# EAGLE schematic CDTV-Clockport (EAGLE 4.16)
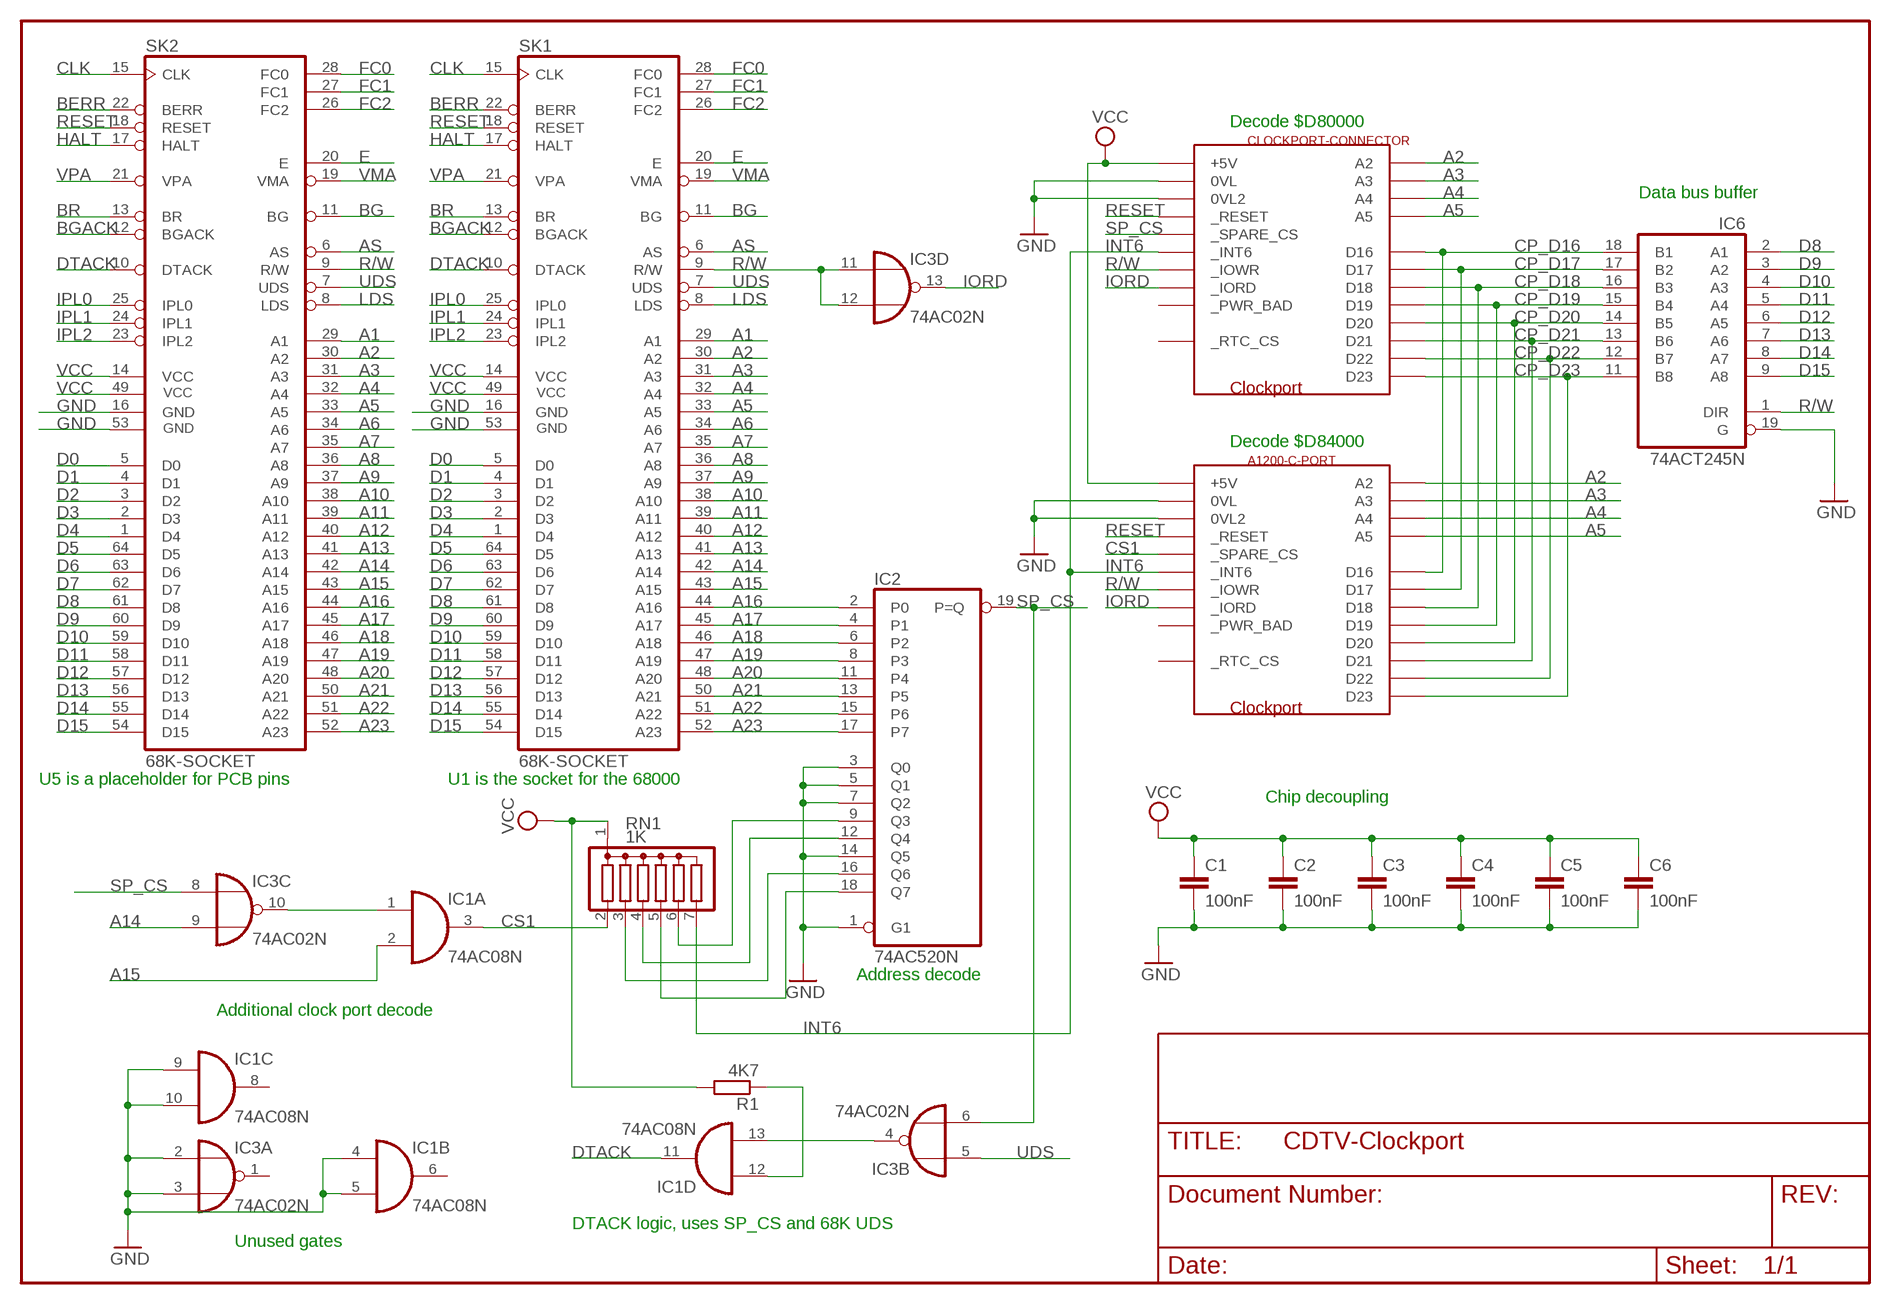
[diagram p0: schematic, sheet 1]

## Parts
C1  100nF  C-EU050-030X075  [C050-030X075]
C2  100nF  C-EU050-030X075  [C050-030X075]
C3  100nF  C-EU050-030X075  [C050-030X075]
C4  100nF  C-EU050-030X075  [C050-030X075]
C5  100nF  C-EU050-030X075  [C050-030X075]
C6  100nF  C-EU050-030X075  [C050-030X075]
CN1  A1200-C-PORT  [2MM-PCB-HEADER]
CN$1  CLOCKPORT-CONNECTOR  [2MM-PCB-HEADER]
IC1  74AC08N  [DIL14]
IC2  74AC520N  [DIL20]
IC3  74AC02N  [DIL14]
IC6  74ACT245N  [DIL20]
R1  4K7  R-EU_0207/7  [0207/7]
RN1  1K  G06R  [SIL7]
SK1  68K-SOCKET  [DIL64-SKT]
SK2  68K-SOCKET  [DIL64-SKT]

## Nets
A1: SK1.29(A1) SK2.29(A1)
A2: CN1.PIN12(A2) CN$1.PIN12(A2) SK1.30(A2) SK2.30(A2)
A3: CN1.PIN11(A3) CN$1.PIN11(A3) SK1.31(A3) SK2.31(A3)
A4: CN1.PIN10(A4) CN$1.PIN10(A4) SK1.32(A4) SK2.32(A4)
A5: CN1.PIN9(A5) CN$1.PIN9(A5) SK1.33(A5) SK2.33(A5)
A6: SK1.34(A6) SK2.34(A6)
A7: SK1.35(A7) SK2.35(A7)
A8: SK1.36(A8) SK2.36(A8)
A9: SK1.37(A9) SK2.37(A9)
A10: SK1.38(A10) SK2.38(A10)
A11: SK1.39(A11) SK2.39(A11)
A12: SK1.40(A12) SK2.40(A12)
A13: SK1.41(A13) SK2.41(A13)
A14: IC3.9(C:I1) SK1.42(A14) SK2.42(A14)
A15: IC1.2(A:I1) SK1.43(A15) SK2.43(A15)
A16: IC2.2(P0) SK1.44(A16) SK2.44(A16)
A17: IC2.4(P1) SK1.45(A17) SK2.45(A17)
A18: IC2.6(P2) SK1.46(A18) SK2.46(A18)
A19: IC2.8(P3) SK1.47(A19) SK2.47(A19)
A20: IC2.11(P4) SK1.48(A20) SK2.48(A20)
A21: IC2.13(P5) SK1.50(A21) SK2.50(A21)
A22: IC2.15(P6) SK1.51(A22) SK2.51(A22)
A23: IC2.17(P7) SK1.52(A23) SK2.52(A23)
AS: SK1.6(AS) SK2.6(AS)
BERR: SK1.22(BERR) SK2.22(BERR)
BG: SK1.11(BG) SK2.11(BG)
BGACK: SK1.12(BGACK) SK2.12(BGACK)
BR: SK1.13(BR) SK2.13(BR)
CLK: SK1.15(CLK) SK2.15(CLK)
CP_D16: CN1.PIN20(D16) CN$1.PIN20(D16) IC6.18(B1)
CP_D17: CN1.PIN19(D17) CN$1.PIN19(D17) IC6.17(B2)
CP_D18: CN1.PIN18(D18) CN$1.PIN18(D18) IC6.16(B3)
CP_D19: CN1.PIN17(D19) CN$1.PIN17(D19) IC6.15(B4)
CP_D20: CN1.PIN16(D20) CN$1.PIN16(D20) IC6.14(B5)
CP_D21: CN1.PIN15(D21) CN$1.PIN15(D21) IC6.13(B6)
CP_D22: CN1.PIN14(D22) CN$1.PIN14(D22) IC6.12(B7)
CP_D23: CN1.PIN13(D23) CN$1.PIN13(D23) IC6.11(B8)
CS1: CN1.PIN4(_SPARE_CS) IC1.3(A:O) RN1.2
D0: SK1.5(D0) SK2.5(D0)
D1: SK1.4(D1) SK2.4(D1)
D2: SK1.3(D2) SK2.3(D2)
D3: SK1.2(D3) SK2.2(D3)
D4: SK1.1(D4) SK2.1(D4)
D5: SK1.64(D5) SK2.64(D5)
D6: SK1.63(D6) SK2.63(D6)
D7: SK1.62(D7) SK2.62(D7)
D8: IC6.2(A1) SK1.61(D8) SK2.61(D8)
D9: IC6.3(A2) SK1.60(D9) SK2.60(D9)
D10: IC6.4(A3) SK1.59(D10) SK2.59(D10)
D11: IC6.5(A4) SK1.58(D11) SK2.58(D11)
D12: IC6.6(A5) SK1.57(D12) SK2.57(D12)
D13: IC6.7(A6) SK1.56(D13) SK2.56(D13)
D14: IC6.8(A7) SK1.55(D14) SK2.55(D14)
D15: IC6.9(A8) SK1.54(D15) SK2.54(D15)
DTACK: IC1.11(D:O) SK1.10(DTACK) SK2.10(DTACK)
E: SK1.20(E) SK2.20(E)
FC0: SK1.28(FC0) SK2.28(FC0)
FC1: SK1.27(FC1) SK2.27(FC1)
FC2: SK1.26(FC2) SK2.26(FC2)
GND: C1.2 C2.2 C3.2 C4.2 C5.2 C6.2 CN1.PIN1(0VL) CN1.PIN21(0VL2) CN$1.PIN1(0VL) CN$1.PIN21(0VL2) IC1.4(B:I0) IC1.5(B:I1) IC1.9(C:I0) IC1.10(C:I1) IC2.1(G1) IC2.3(Q0) IC2.5(Q1) IC2.7(Q2) IC2.14(Q5) IC3.2(A:I0) IC3.3(A:I1) IC6.19(G) SK1.16(GND) SK1.53(GND) SK2.16(GND) SK2.53(GND)
HALT: SK1.17(HALT) SK2.17(HALT)
INT6: CN1.PIN3(_INT6) CN$1.PIN3(_INT6) RN1.7
IORD: CN1.PIN7(_IORD) CN$1.PIN7(_IORD) IC3.13(D:O)
IPL0: SK1.25(IPL0) SK2.25(IPL0)
IPL1: SK1.24(IPL1) SK2.24(IPL1)
IPL2: SK1.23(IPL2) SK2.23(IPL2)
LDS: SK1.8(LDS) SK2.8(LDS)
N$1: IC1.1(A:I0) IC3.10(C:O)
N$2: IC2.9(Q3) RN1.6
N$3: IC2.12(Q4) RN1.4
N$4: IC2.16(Q6) RN1.3
N$5: IC2.18(Q7) RN1.5
N$6: IC1.13(D:I1) IC3.4(B:O)
N$7: IC1.12(D:I0) R1.1
R/W: CN1.PIN8(_IOWR) CN$1.PIN8(_IOWR) IC3.11(D:I0) IC3.12(D:I1) IC6.1(DIR) SK1.9(R/W) SK2.9(R/W)
RESET: CN1.PIN22(_RESET) CN$1.PIN22(_RESET) SK1.18(RESET) SK2.18(RESET)
SP_CS: CN$1.PIN4(_SPARE_CS) IC2.19(P=Q) IC3.6(B:I1) IC3.8(C:I0)
UDS: IC3.5(B:I0) SK1.7(UDS) SK2.7(UDS)
VCC: C1.1 C2.1 C3.1 C4.1 C5.1 C6.1 CN1.PIN2(+5V) CN$1.PIN2(+5V) R1.2 RN1.1 SK1.14(VCC) SK1.49(VCC) SK2.14(VCC) SK2.49(VCC)
VMA: SK1.19(VMA) SK2.19(VMA)
VPA: SK1.21(VPA) SK2.21(VPA)
Unconnected: CN1.PIN5(_RTC_CS) CN1.PIN6(_PWR_BAD) CN$1.PIN5(_RTC_CS) CN$1.PIN6(_PWR_BAD) IC1.6(B:O) IC1.8(C:O) IC3.1(A:O)

## Notes on the sheet
- Decode $D80000
- Data bus buffer
- Decode $D84000
- U5 is a placeholder for PCB pins | U1 is the socket for the 68000
- Chip decoupling
- Address decode
- Additional clock port decode
- DTACK logic, uses SP_CS and 68K UDS
- Unused gates

## Power pins joined to a net without a drawn wire
GND: IC1.7(P:GND) IC2.10(GND) IC3.7(P:GND) IC6.10(GND)
VCC: IC1.14(P:VCC) IC2.20(VCC) IC3.14(P:VCC) IC6.20(VCC)

## Library data of the parts
C1-C6 = rcl:C-EU: CAPACITOR, European symbol
CN1 = ians:A1200-C-PORT: A1200 2mm spacing clockport
CN$1 = ians:CLOCKPORT-CONNECTOR: A1200 2mm clockport header for an add in board
IC1 = 74xx-eu:74*08: Quad 2-input AND gate
IC2 = 74xx-eu:74*520: 8-bit COMPARATOR
IC3 = 74xx-eu:74*02: Quad 2-input NOR gate
IC6 = 74xx-eu:74*245: Octal BUS TRANSCEIVER, 3-state
R1 = rcl:R-EU_: RESISTOR, European symbol
RN1 = resistor-sil:G06R: SIL RESISTOR
SK1 SK2 = ians:68K-SOCKET: MC68000 CPU socket